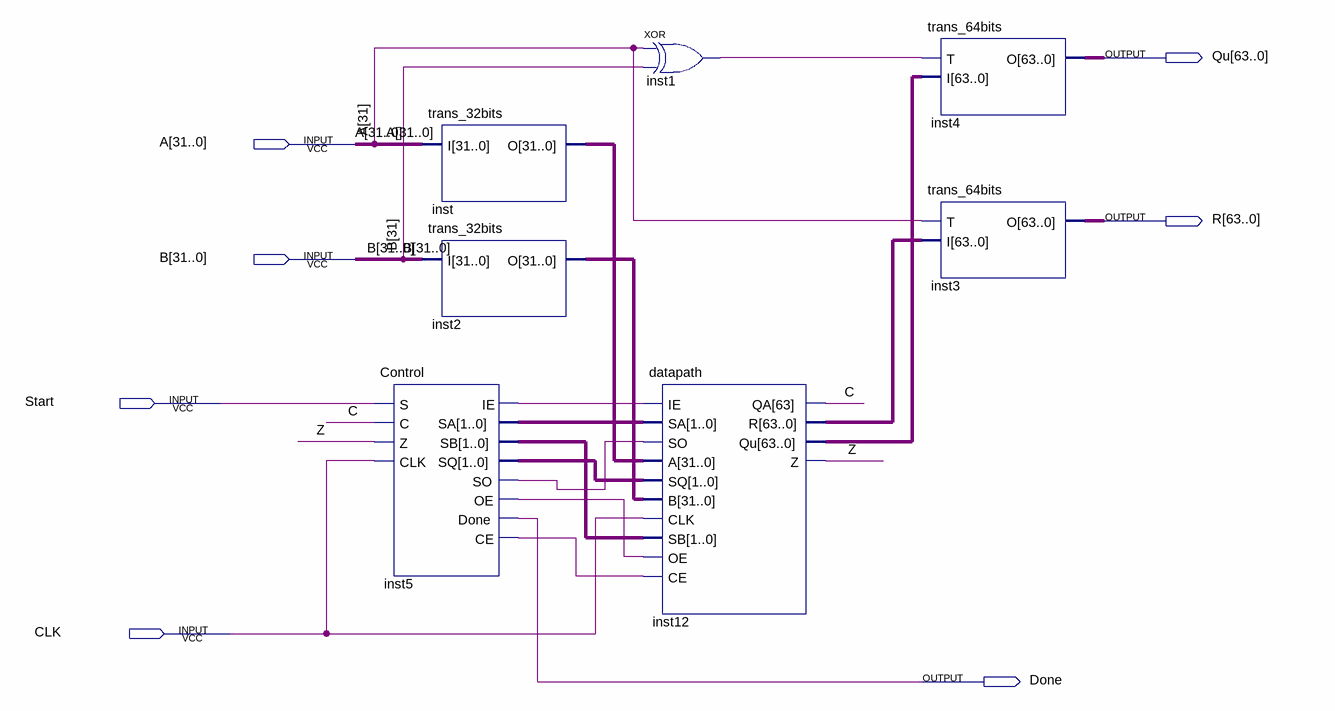
[diagram p0: schematic sheet]
// Quartus schematic signedVXL.bdf as structural Verilog: 7 symbols, 7 pins
module signedVXL (
  input  [31:0] A,
  input  [31:0] B,
  input  Start,
  input  CLK,
  output [63:0] Qu,
  output [63:0] R,
  output Done
);

  wire C, inst1_out, inst5_ce, inst5_ie, inst5_oe, inst5_so, Z;
  wire [1:0] inst5_sa, inst5_sb, inst5_sq;
  wire [31:0] inst2_o, inst_o;
  wire [63:0] inst12_qu, inst12_r;

  Control inst5 (
    .S(Start), .C(C), .Z(Z), .CLK(CLK), .IE(inst5_ie), .SA(inst5_sa), .SB(inst5_sb), .SQ(inst5_sq),
    .SO(inst5_so), .OE(inst5_oe), .Done(Done), .CE(inst5_ce));
  trans_32bits inst (.I(A), .O(inst_o));
  trans_32bits inst2 (.I(B), .O(inst2_o));
  xor inst1 (inst1_out, A[31], B[31]);
  datapath inst12 (
    .IE(inst5_ie), .SA(inst5_sa), .SO(inst5_so), .A(inst_o), .SQ(inst5_sq), .B(inst2_o), .CLK(CLK),
    .SB(inst5_sb), .OE(inst5_oe), .CE(inst5_ce), .QA(C), .R(inst12_r), .Qu(inst12_qu), .Z(Z));
  trans_64bits inst4 (.T(inst1_out), .I(inst12_qu), .O(Qu));
  trans_64bits inst3 (.T(A[31]), .I(inst12_r), .O(R));
endmodule
